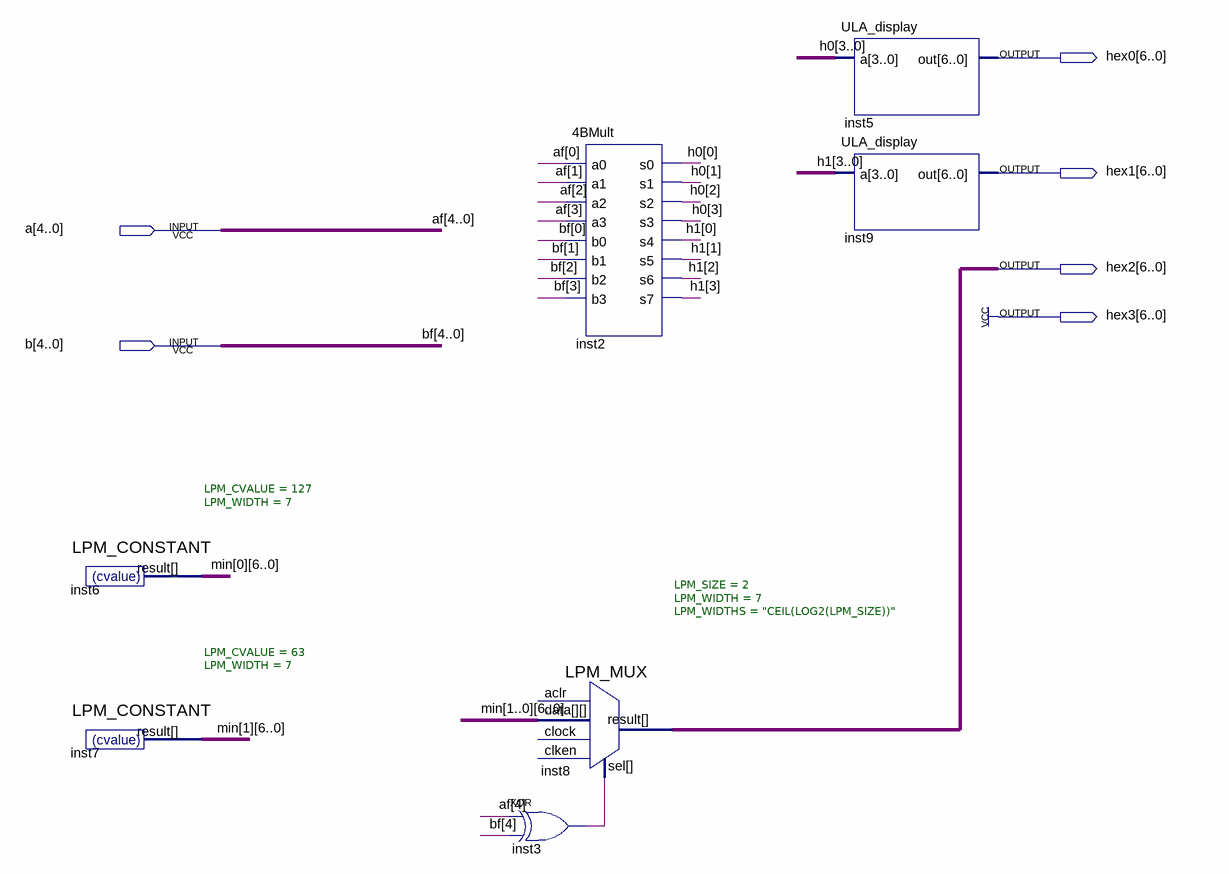
[diagram p0: schematic sheet]
// Quartus schematic ULA_mult.bdf as structural Verilog: 7 symbols, 6 pins
module ULA_mult (
  input  [4:0] a,
  input  [4:0] b,
  output [6:0] hex0,
  output [6:0] hex1,
  output [6:0] hex2,
  output [6:0] hex3
);

  wire inst3_out;
  wire [3:0] h0, h1;
  wire [6:0] min_0, min_1;

  LPM_CONSTANT #(.LPM_CVALUE(127), .LPM_WIDTH(7)) inst6 (.result(min_0));
  LPM_CONSTANT #(.LPM_CVALUE(63), .LPM_WIDTH(7)) inst7 (.result(min_1));
  \4BMult  inst2 (
    .a0(a[0]), .a1(a[1]), .a2(a[2]), .a3(a[3]), .b0(b[0]), .b1(b[1]), .b2(b[2]), .b3(b[3]), .s0(h0[0]),
    .s1(h0[1]), .s2(h0[2]), .s3(h0[3]), .s4(h1[0]), .s5(h1[1]), .s6(h1[2]), .s7(h1[3]));
  LPM_MUX #(.LPM_SIZE(2), .LPM_WIDTH(7), .LPM_WIDTHS("CEIL(LOG2(LPM_SIZE))")) inst8 (
    .data({min_1, min_0}), .sel(inst3_out), .result(hex2));  // open: clock, aclr, clken
  xor inst3 (inst3_out, a[4], b[4]);
  ULA_display inst5 (.a(h0), .out(hex0));
  ULA_display inst9 (.a(h1), .out(hex1));

  assign hex3 = {7{1'b1}};

  // Other names for the same wires on the sheet: af[4:0] = a; bf[4:0] = b
endmodule
